# Altium schematic sheet Input.SchDoc
size A; SheetNumber: 2; SheetTotal: 5
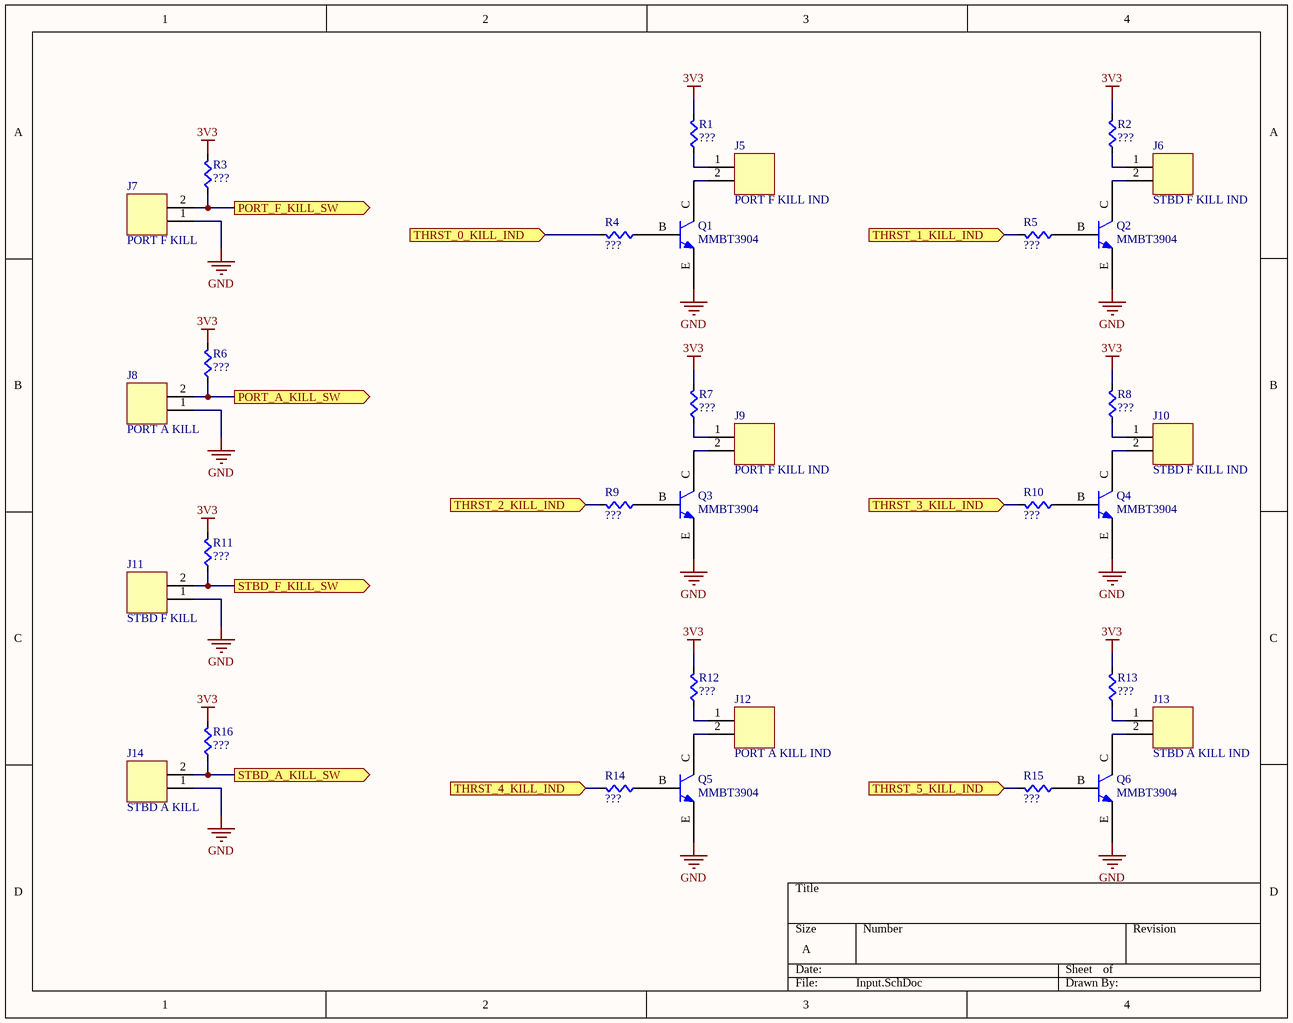
[diagram p0: Input.SchDoc]

## Parts
J5  PORT F KILL IND  [MOLEX-HDR-1X2-SHERLOCK-VERT]
J6  STBD F KILL IND  [MOLEX-HDR-1X2-SHERLOCK-VERT]
J7  PORT F KILL  [MOLEX-HDR-1X2-SHERLOCK-VERT]
J8  PORT A KILL  [MOLEX-HDR-1X2-SHERLOCK-VERT]
J9  PORT F KILL IND  [MOLEX-HDR-1X2-SHERLOCK-VERT]
J10  STBD F KILL IND  [MOLEX-HDR-1X2-SHERLOCK-VERT]
J11  STBD F KILL  [MOLEX-HDR-1X2-SHERLOCK-VERT]
J12  PORT A KILL IND  [MOLEX-HDR-1X2-SHERLOCK-VERT]
J13  STBD A KILL IND  [MOLEX-HDR-1X2-SHERLOCK-VERT]
J14  STBD A KILL  [MOLEX-HDR-1X2-SHERLOCK-VERT]
Q1  MMBT3904  [MMBT3904]
Q2  MMBT3904  [MMBT3904]
Q3  MMBT3904  [MMBT3904]
Q4  MMBT3904  [MMBT3904]
Q5  MMBT3904  [MMBT3904]
Q6  MMBT3904  [MMBT3904]
R1  value ???  [RES0603]  (hidden comment: Res)
R2  value ???  [RES0603]  (hidden comment: Res)
R3  value ???  [RES0603]  (hidden comment: Res)
R4  value ???  [RES0603]  (hidden comment: Res)
R5  value ???  [RES0603]  (hidden comment: Res)
R6  value ???  [RES0603]  (hidden comment: Res)
R7  value ???  [RES0603]  (hidden comment: Res)
R8  value ???  [RES0603]  (hidden comment: Res)
R9  value ???  [RES0603]  (hidden comment: Res)
R10  value ???  [RES0603]  (hidden comment: Res)
R11  value ???  [RES0603]  (hidden comment: Res)
R12  value ???  [RES0603]  (hidden comment: Res)
R13  value ???  [RES0603]  (hidden comment: Res)
R14  value ???  [RES0603]  (hidden comment: Res)
R15  value ???  [RES0603]  (hidden comment: Res)
R16  value ???  [RES0603]  (hidden comment: Res)

## Ports
PORT_A_KILL_SW (out), PORT_F_KILL_SW (out), STBD_A_KILL_SW (out), STBD_F_KILL_SW (out), THRST_0_KILL_IND (in), THRST_1_KILL_IND (in), THRST_2_KILL_IND (in), THRST_3_KILL_IND (in), THRST_4_KILL_IND (in), THRST_5_KILL_IND (in)

## Nets
3V3: R1.1(A) R2.1(A) R3.1(A) R6.1(A) R7.1(A) R8.1(A) R11.1(A) R12.1(A) R13.1(A) R16.1(A)
GND: J7.1 J8.1 J11.1 J14.1 Q1.E Q2.E Q3.E Q4.E Q5.E Q6.E
PORT_A_KILL_SW: J8.2 R6.2(B) ; port PORT_A_KILL_SW
PORT_F_KILL_SW: J7.2 R3.2(B) ; port PORT_F_KILL_SW
STBD_A_KILL_SW: J14.2 R16.2(B) ; port STBD_A_KILL_SW
STBD_F_KILL_SW: J11.2 R11.2(B) ; port STBD_F_KILL_SW
THRST_0_KILL_IND: R4.1(A) ; port THRST_0_KILL_IND
THRST_1_KILL_IND: R5.1(A) ; port THRST_1_KILL_IND
THRST_2_KILL_IND: R9.1(A) ; port THRST_2_KILL_IND
THRST_3_KILL_IND: R10.1(A) ; port THRST_3_KILL_IND
THRST_4_KILL_IND: R14.1(A) ; port THRST_4_KILL_IND
THRST_5_KILL_IND: R15.1(A) ; port THRST_5_KILL_IND
NetJ5_1: J5.1 R1.2(B)
NetJ5_2: J5.2 Q1.C
NetJ6_1: J6.1 R2.2(B)
NetJ6_2: J6.2 Q2.C
NetJ9_1: J9.1 R7.2(B)
NetJ9_2: J9.2 Q3.C
NetJ10_1: J10.1 R8.2(B)
NetJ10_2: J10.2 Q4.C
NetJ12_1: J12.1 R12.2(B)
NetJ12_2: J12.2 Q5.C
NetJ13_1: J13.1 R13.2(B)
NetJ13_2: J13.2 Q6.C
NetQ1_B: Q1.B R4.2(B)
NetQ2_B: Q2.B R5.2(B)
NetQ3_B: Q3.B R9.2(B)
NetQ4_B: Q4.B R10.2(B)
NetQ5_B: Q5.B R14.2(B)
NetQ6_B: Q6.B R15.2(B)

## Library data of the parts
J5-J14 = MOLEX-HDR-1x2-SHERLOCK_VERT: Header, Molex, 2mm Pitch Sherlock Header, Single Row, Vertical, 2 Circuits, Length 3.3mm, 0353620250; Manufacturer Part Number: *; Order Part Number: *
Q1-Q6 = MMBT3904: TRANS NPN 40V 0.2A SOT-23; Manufacturer 1: Fairchild Semiconductor; Supplier 1: Digi-Key; Supplier Part Number 1: MMBT3904FSCT-ND; Manufacturer Part Number 1: MMBT3904
R1-R16 = Res: Supplier 1: Digi-Key; Supplier Part Number 1: RMCF0603JT10K0CT-ND